# EAGLE design untitled (EAGLE 5.08)
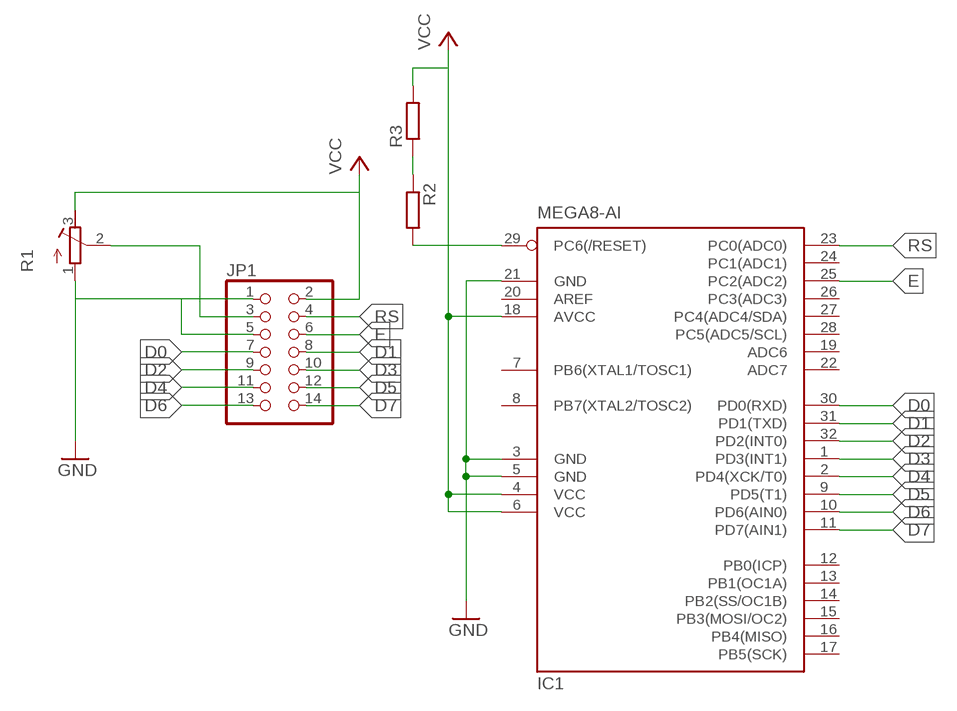
[diagram p0: schematic, sheet 1]

## Parts
IC1  MEGA8-AI  [TQFP32-08]
JP1  PINHD-2X7  [2X07]
R1  R-TRIMM64P  [RTRIM64P]
R2  R-EU_M1206  [M1206]
R3  R-EU_M1206  [M1206]

## Nets
D0: IC1.30(PD0(RXD)) JP1.7
D1: IC1.31(PD1(TXD)) JP1.8
D2: IC1.32(PD2(INT0)) JP1.9
D3: IC1.1(PD3(INT1)) JP1.10
D4: IC1.2(PD4(XCK/T0)) JP1.11
D5: IC1.9(PD5(T1)) JP1.12
D6: IC1.10(PD6(AIN0)) JP1.13
D7: IC1.11(PD7(AIN1)) JP1.14
E: IC1.25(PC2(ADC2)) JP1.6
GND: IC1.3(GND) IC1.5(GND) IC1.21(GND) JP1.1 JP1.5 R1.1(E)
N$1: IC1.29(PC6(/RESET)) R2.2
N$2: JP1.3 R1.2(S)
N$3: R2.1 R3.1
RS: IC1.23(PC0(ADC0)) JP1.4
VCC: IC1.4(VCC) IC1.6(VCC) IC1.18(AVCC) JP1.2 R1.3(A) R3.2
Unconnected: IC1.7(PB6(XTAL1/TOSC1)) IC1.8(PB7(XTAL2/TOSC2)) IC1.12(PB0(ICP)) IC1.13(PB1(OC1A)) IC1.14(PB2(SS/OC1B)) IC1.15(PB3(MOSI/OC2)) IC1.16(PB4(MISO)) IC1.17(PB5(SCK)) IC1.19(ADC6) IC1.20(AREF) IC1.22(ADC7) IC1.24(PC1(ADC1)) IC1.26(PC3(ADC3)) IC1.27(PC4(ADC4/SDA)) IC1.28(PC5(ADC5/SCL))

## Library data of the parts
IC1 = atmel:MEGA8: MICROCONTROLLER 8 Kbytes FLASH, 1 kbytes SRAM, 512 bytes EEPROM, USART, 6-channel 10 bit ADC, 2-channel 8 bit ADC Pin compatible with Atmega48, ATMega88, ATMega168 Source: avr.lbr
JP1 = pinhead:PINHD-2X7: PIN HEADER
R1 = resistor:R-TRIMM: Trimm resistor
R2 R3 = resistor:R-EU_: RESISTOR, European symbol

## Board
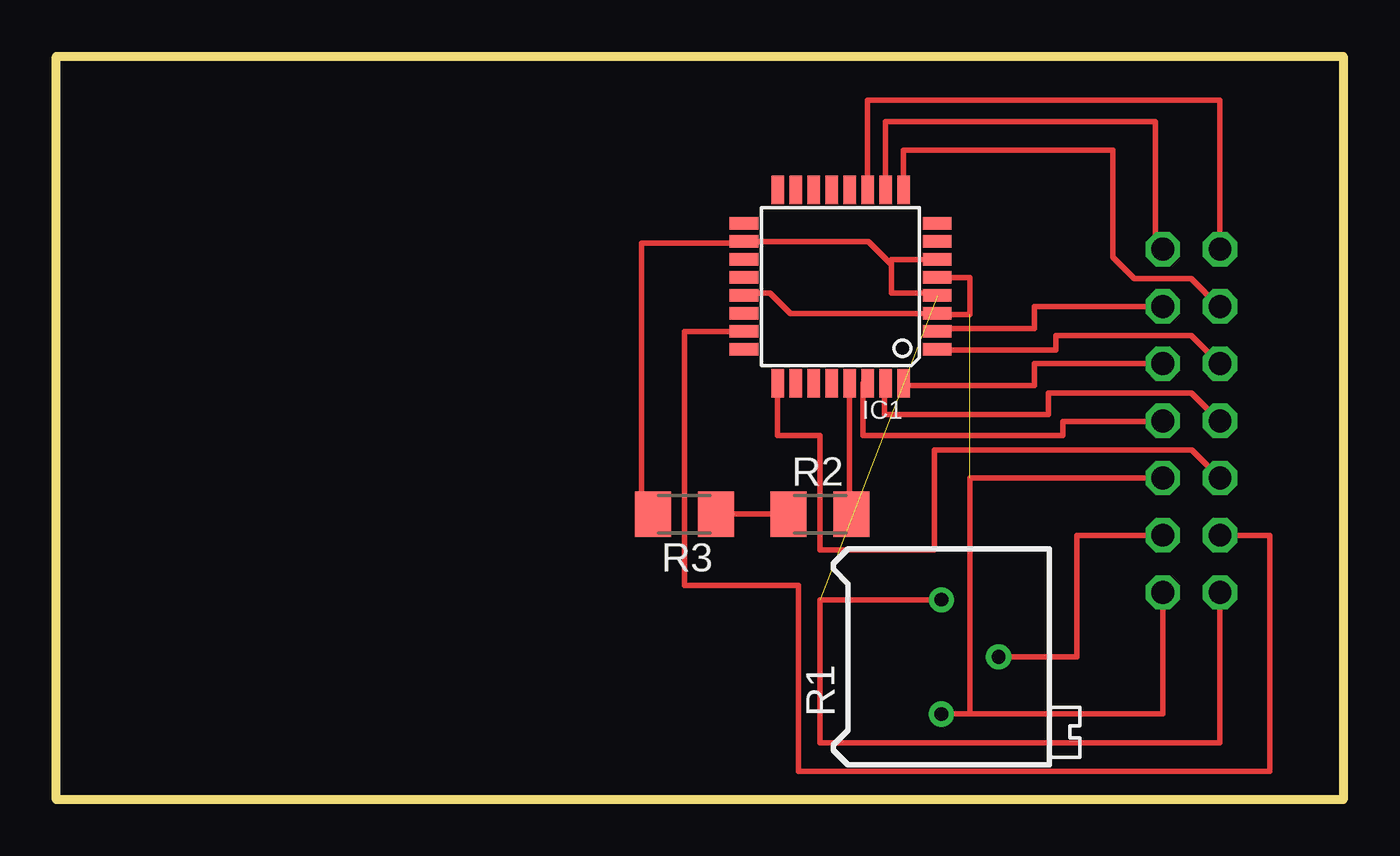
[diagram p1: board, top side]
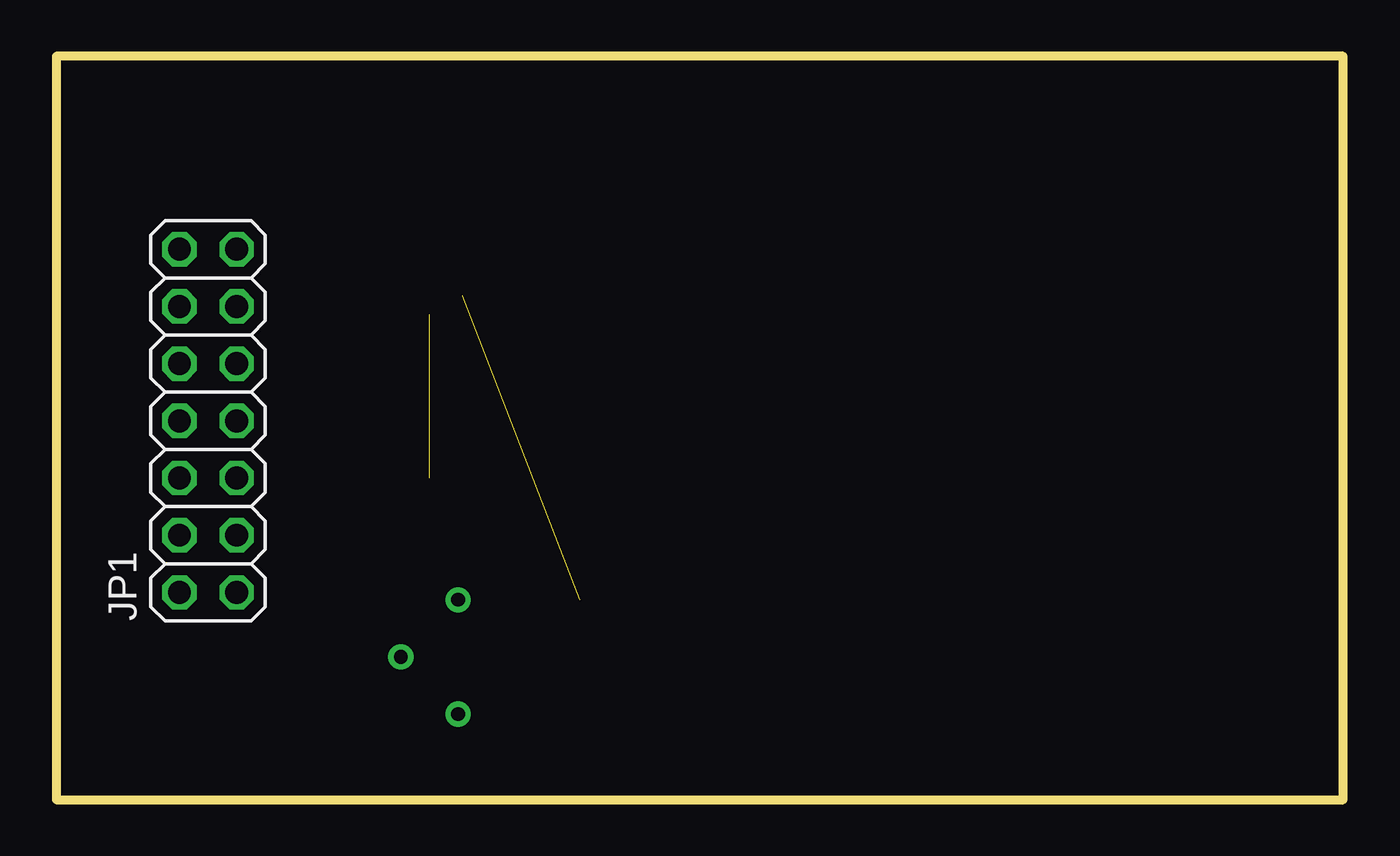
[diagram p2: board, bottom side, seen from below]

Size 57.15 x 33.02 mm. Coordinates in mm from the lower left corner, seen from the top.
Outline: 0,33 0,0 57.15,0 57.15,33.02 0,33.02
Copper layers (1*16): Top 0.035mm / dielectric 1.5mm / Bottom 0.035mm
Design rules "default *": minimum track width 16mil, minimum drill 5mil, track to track 16mil, track to pad 16mil, pad to pad 16mil, via to via 16mil, smd to smd 16mil, copper to edge 40mil, drill to drill 40mil, minimum pad ring 10mil, minimum via ring 12mil, stop-mask expansion 4mil, vias tented up to drill 0mil, thermal gap 10mil

### Footprints (pad centres in the part's own frame; a part is rotated, then mirrored left to right if it is on the bottom)
TQFP32-08 = smd 1.27 x 0.559: 1 -4.293,2.8; 2 -4.293,2; 3 -4.293,1.2; 4 -4.293,0.4; 5 -4.293,-0.4; 6 -4.293,-1.2; 7 -4.293,-2; 8 -4.293,-2.8; 17 4.293,-2.8; 18 4.293,-2; 19 4.293,-1.2; 20 4.293,-0.4; 21 4.293,0.4; 22 4.293,1.2; 23 4.293,2; 24 4.293,2.8 | smd 0.559 x 1.27: 9 -2.8,-4.293; 10 -2,-4.293; 11 -1.2,-4.293; 12 -0.4,-4.293; 13 0.4,-4.293; 14 1.2,-4.293; 15 2,-4.293; 16 2.8,-4.293; 25 2.8,4.293; 26 2,4.293; 27 1.2,4.293; 28 0.4,4.293; 29 -0.4,4.293; 30 -1.2,4.293; 31 -2,4.293; 32 -2.8,4.293
2X07 = drill 1.016 octagon: 1 -7.62,-1.27; 2 -7.62,1.27; 3 -5.08,-1.27; 4 -5.08,1.27; 5 -2.54,-1.27; 6 -2.54,1.27; 7 0,-1.27; 8 0,1.27; 9 2.54,-1.27; 10 2.54,1.27; 11 5.08,-1.27; 12 5.08,1.27; 13 7.62,-1.27; 14 7.62,1.27
RTRIM64P = drill 0.61 round: 1 0,-2.54; 2 2.54,0; 3 0,2.54
M1206 = smd 1.6 x 2: 1 -1.4,0; 2 1.4,0

### Placement (x,y rotation side)
IC1  34.83,22.8 180 top
JP1  50.41,16.83 90 bottom
R1  39.31,6.34 0 top
R2  33.92,12.68 0 top
R3  27.9,12.68 180 top

### Tracks (layer width: path | path; a pad name or v marks a point on that pad's centre or on a via)
D0
  Top 0.254: IC1.30 35.82,18.5 35.82,16.17 44.7,16.17 44.7,16.8 49.14,16.8 JP1.7
D1
  Top 0.254: JP1.8 51.65,16.83 50.4,18.07 44.06,18.07 44.06,17.12 36.77,17.12 36.77,18.45 IC1.31
D2
  Top 0.254: JP1.9 43.43,19.37 43.43,18.39 37.63,18.39 IC1.32
D3
  Top 0.254: JP1.10 51.64,19.37 50.4,20.61 44.38,20.61 44.38,19.97 39.12,19.97 IC1.1
D4
  Top 0.254: JP1.11 43.43,21.91 43.43,20.92 39.12,20.92 IC1.2
D5
  Top 0.254: JP1.12 51.64,21.91 50.4,23.14 47.87,23.14 46.92,24.09 46.92,28.85 37.63,28.85 IC1.9
D6
  Top 0.254: JP1.13 48.82,24.45 48.82,30.11 36.83,30.11 IC1.10
D7
  Top 0.254: JP1.14 51.67,31.07 36.03,31.07 IC1.11
E
  Top 0.254: IC1.25 32.02,18.5 32.02,16.17 33.92,16.17 33.92,11.1 38.99,11.1 38.99,15.53 50.44,15.53 JP1.6
GND  (1 unrouted)
  Top 0.254: IC1.5 40.58,23.2 40.58,21.56 39.12,21.56 IC1.3 32.61,21.6 31.7,22.51 30.65,22.51 IC1.21 | JP1.1 49.13,3.8 40.58,3.8 | 40.58,3.8 R1.1 | JP1.5 40.58,14.29 40.58,3.8
N$1
  Top 0.254: 35.19,18.5 IC1.29 35.23,12.68 R2.2
N$2
  Top 0.254: R1.2 45.33,6.34 45.33,11.73 49.14,11.73 JP1.3
N$3
  Top 0.254: R2.1 R3.1
RS
  Top 0.254: IC1.23 27.9,20.8 27.9,9.51 32.97,9.51 32.97,1.27 53.89,1.27 53.89,11.73 51.68,11.73 JP1.4
VCC  (1 unrouted)
  Top 0.254: IC1.6 37.09,24 37.09,23.77 | 37.09,23.77 37.09,22.51 39.12,22.51 IC1.4 | 37.09,23.77 36.07,24.8 IC1.18 30.54,24.73 25.99,24.73 25.99,12.68 R3.2 | JP1.2 51.67,2.54 33.92,2.54 33.92,8.88 R1.3